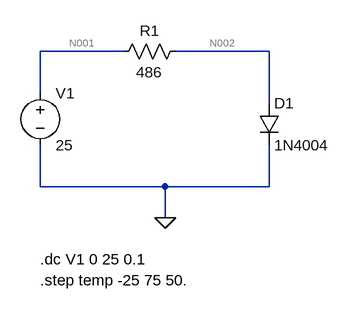
[diagram p0: schematic Diodo4004_1.asc]
Diodo4004_1.asc, the LTspice schematic file:
Version 4.1
SHEET 1 880 680
WIRE 176 48 48 48
WIRE 400 48 256 48
WIRE 48 112 48 48
WIRE 400 128 400 48
WIRE 48 256 48 192
WIRE 240 256 48 256
WIRE 400 256 400 192
WIRE 400 256 240 256
WIRE 240 304 240 256
FLAG 240 304 0
SYMBOL voltage 48 96 R0
SYMATTR InstName V1
SYMATTR Value 25
SYMBOL res 272 32 R90
WINDOW 0 0 56 VBottom 2
WINDOW 3 32 56 VTop 2
SYMATTR InstName R1
SYMATTR Value 486
SYMBOL diode 384 128 R0
SYMATTR InstName D1
SYMATTR Value 1N4004
TEXT 48 368 Left 2 !.dc V1 0 25 0.1
TEXT 48 400 Left 2 !.step temp -25 75 50.

The netlist it stands for:
* Diodo4004_1.asc
V1 N001 0 25
R1 N002 N001 486
D1 N002 0 1N4004
.model D D
.lib standard.dio
.dc V1 0 25 0.1
.step temp -25 75 50.
.backanno
.end

* Results of the author's LTspice run, read from the files saved beside the schematic
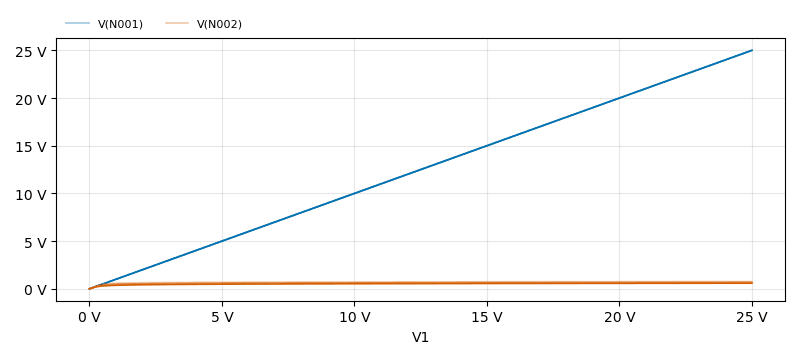
[diagram p1: DC transfer characteristic of Diodo4004_1.asc, plotted from the saved traces]
* DC transfer characteristic, 3 runs:
*   V(N001) [run 1]: 0 V at V1=0 V, 25 V at V1=25 V, min 0 V, max 25 V
*   V(N001) [run 2]: 0 V at V1=0 V, 25 V at V1=25 V, min 0 V, max 25 V
*   V(N001) [run 3]: 0 V at V1=0 V, 25 V at V1=25 V, min 0 V, max 25 V
*   V(N002) [run 1]: 0 V at V1=0 V, 759.7 mV at V1=25 V, min 0 V, max 759.7 mV
*   V(N002) [run 2]: 0 V at V1=0 V, 675.1 mV at V1=25 V, min 0 V, max 675.1 mV
*   V(N002) [run 3]: 0 V at V1=0 V, 588.4 mV at V1=25 V, min 0 V, max 588.4 mV